# Altium schematic sheet Sheet.SchDoc
size A; SheetNumber: 1; SheetTotal: 1; SPICEModelCacheCYSPSLZW: <root> / <DocumentId>CYSPSLZW</DocumentId> / </root>
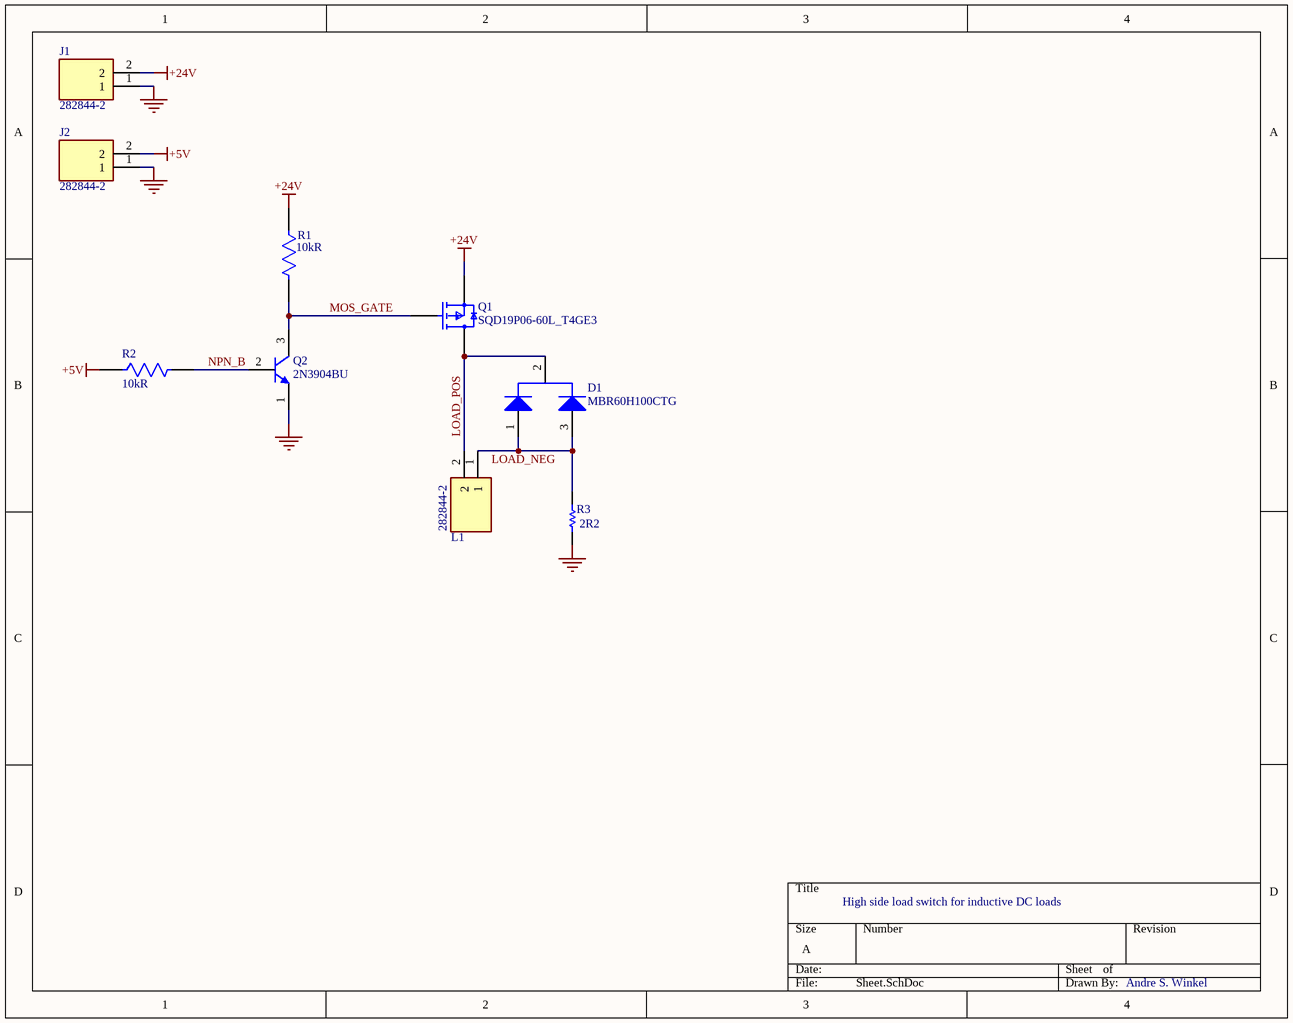
[diagram p0: Sheet.SchDoc]

## Parts
D1  MBR60H100CTG  [ONSC-TO-220-3-221A-09_AF]
J1  282844-2  [2828442]
J2  282844-2  [2828442]
L1  282844-2  [2828442]
Q1  SQD19P06-60L_T4GE3  [FP-T13-0592-MFG]
Q2  2N3904BU  [FAIR-TO-92]
R1  Resistance: 10kR  [FP-CRCW0805-e3-IPC_A]  (hidden comment: CRCW080510K0FKEA)
R2  Resistance: 10kR  [FP-CRCW0805-e3-IPC_A]  (hidden comment: CRCW080510K0FKEA)
R3  Resistance: 2R2  [RESC1005X40X25NL05T10]  (hidden comment: RC0402JR-072R2L)

## Nets
+5V: J2.2 R2.1
+24V: J1.2 Q1.3(S) R1.1
GND: J1.1 J2.1 Q2.1(E) R3.2
LOAD_NEG: D1.1(A1) D1.3(A2) L1.1 R3.1
LOAD_POS: D1.2(K) L1.2 Q1.4(D)
MOS_GATE: Q1.1(G) Q2.3(C) R1.2
NPN_B: Q2.2(B) R2.2

## Notes on the sheet
- High side load switch for inductive DC loads
- Andre S. Winkel

## Library data of the parts
D1 = CMP-1055-00640-1: SWITCHMODE(TM) Power Rectifier, 100 V, 60 A, 3-Pin TO-220, Pb-Free, Tube; Manufacturer: On Semiconductor; IFSM Max (A): 350; Configuration: Common Cathode; Packing: Tube; PackageReference: TO-220-3-221A-09_AF; RoHS: TRUE; DatasheetVersion: Rev. 5; ComponentLink3Description: Package Specification; PackageVersion: Rev. AF; ComponentLink2URL: http://www.onsemi.cn/pub_link/Collateral/MBR60H100CT-D.PDF; PackageDescription: 3-Pin Flange Mount, Vertical Straight Lead, Body 9.97 x 4.445 mm, Pitch 2.54 mm; ComponentLink2Description: Datasheet; ComponentLink1Description: Manufacturer URL; ComponentLink1URL: http://www.onsemi.com/; ComponentLink3URL: http://www.onsemi.cn/pub_link/Collateral/MCR8S-D.PDF; Mounting Technology: Through Hole; PartNumber: MBR60H100CTG
J1 J2 L1 = 282844-2: Connector; Manufacturer_Name: TE Connectivity; Datasheet Link: https://www.te.com/commerce/DocumentDelivery/DDEController?Action=srchrtrv&DocNm=1-1773458-1_EURO_STYLE_QRG&DocType=Data%20Sheet&DocLang=English&PartCntxt=282844-2&DocFormat=pdf; Height: 15.2mm; Manufacturer_Part_Number: 282844-2; Mouser Part Number: 571-282844-2; Mouser Price/Stock: https://www.mouser.co.uk/ProductDetail/TE-Connectivity/282844-2?qs=gdajpSf3VLeviVN6hiKaSg%3D%3D; Arrow Part Number: 282844-2; Arrow Price/Stock: https://www.arrow.com/en/products/282844-2/te-connectivity?region=europe
Q1 = CMP-02550-000224-1: MOSFET P-CH 60V 20A TO252AA; Manufacturer: Vishay; Pulse Drain Current: -80A; Depletion Mode: False; Threshold Vgs Min: -1.5V; Input Capacitace At Vds: 1192pF @ -25V; Continuous Drain Current: -20A; Rthja Max: 50°C/W; Max Junction Temp: +175°C; Turn On Delay Time: 7ns; Typ Forward Diode Voltage: -0.85V; Turn Off Delay Time: 25ns; Drain To Source Voltage: -60V; Number Of P Channels: 1; Power Dissipation: 46W; Gate To Source Voltage: 20V; Gate Charge At Vgs: 27nC @ -10V; Automotive Grade: Grade 0; Transconductance: 20S; Threshold Vgs Max: -2.5V; Drain To Source Resistance: 0.046Ω; RoHS: TRUE; ComponentLink2URL: http://www.vishay.com/docs/65158/sqd19p06.pdf; Octopart: https://octopart.com/sqd19p06-60l_t4ge3-vishay-82363551; Package: T13-0592; Temperature: -55°C to +175°C; Device Class L2: Transistors; Automotive: Yes; ComponentLink2Description: Datasheet; Mouser Description: MOSFET P-Channel Automotive 60V 20A 3-Pin TO-252 T/R; Max Forward Diode Voltage: -1.5V; Number Of Channels: 1; Temperature Range Low: -55°C; Device Class L1: Discrete Semiconductors; Height: 2.507mm; Digikey Description: MOSFET P-CH 60V 20A TO252AA; Device Class L3: MOSFETs; Manufacturer Part Number: SQD19P06-60L_T4GE3; Temperature Range High: +175°C; Lead Free: Yes; Drain To Source Breakdown Voltage: -60V; Category: Trans
Q2 = CMP-2000-04944-1: NPN General-Purpose Amplifier, 40 V VCEO, 0.2 A, -55 to 150 degC, 2-Pin TO-92, RoHS, Bulk; Manufacturer: FairchildSemiconductor; Maximum Collector Base Voltage: 60V; Minimum DC Current Gain: 40@0.1mA@1V; Maximum Collector Emitter Voltage: 40V; Maximum DC Collector Current: 0.2A; Rad Hard: No; Maximum Operating Frequency: 300(Min)MHz; Maximum Collector Emitter Saturation Voltage: 0.2@1mA@10mA; Maximum Power Dissipation: 625mW; Package Description: 3-Pin Transistor Outline Package, Body Dia 4.79 mm, Pitch 1.27 mm; Package Reference: TO-92; Pin Count: 3; Operating Temperature: -55to150degC; Category: GPBJT; Manufacturer URL: https://www.fairchildsemi.com/; Datasheet URL: https://datasheet.ciiva.com/4722/2n3904-82270-4722369.pdf; Package: 3TO-92; Packaging: Bulk; Type: NPN; Datasheet Version: Rev. 1.1.0, 10/2014; Mounting: ThroughHole
R1 R2 = CMP-2001-04908-2: RES Thick Film, 10kΩ, 1%, 0.125W, 100ppm/°C, 0805; Voltage Rating (DC): 150V; Power Rating: 125mW; Weight: 0.000194oz; Package Quantity: 5000; Military Standard: Not; Max Operating Temperature: 155°C; Temperature Coefficient: 100ppm/°C; Contact Plating: Tin; Width: 1.25mm; Height: 0.45mm; Radiation Hardening: No; Tolerance: 1%; Min Operating Temperature: -55°C; Voltage Rating: 150V; Length: 2mm; Depth: 1.25mm; Termination: SMD/SMT; Packaging: Tape and Reel; Case/Package: 0805; Case Code (Metric): 2012; Lead Free: Lead Free; Case Code (Imperial): 0805; Composition: Thick Film
R3 = CMP-2002-07977-1: Manufacturer: Yageo / Phycomp; Part Number: RC0402JR-072R2L